# EasyEDA Pro project ProPrj_GeniusGateway_2025-07-29.epro

# Schematic Main
Board Name: Main; Create Date: 2025-07-15; Page Name: P1; Project Name: GeniusGateway; Schematic Name: Main; Update Date: 2025-07-18; Company: EasyEDA.com; Page Size: A4; Version: V1.0
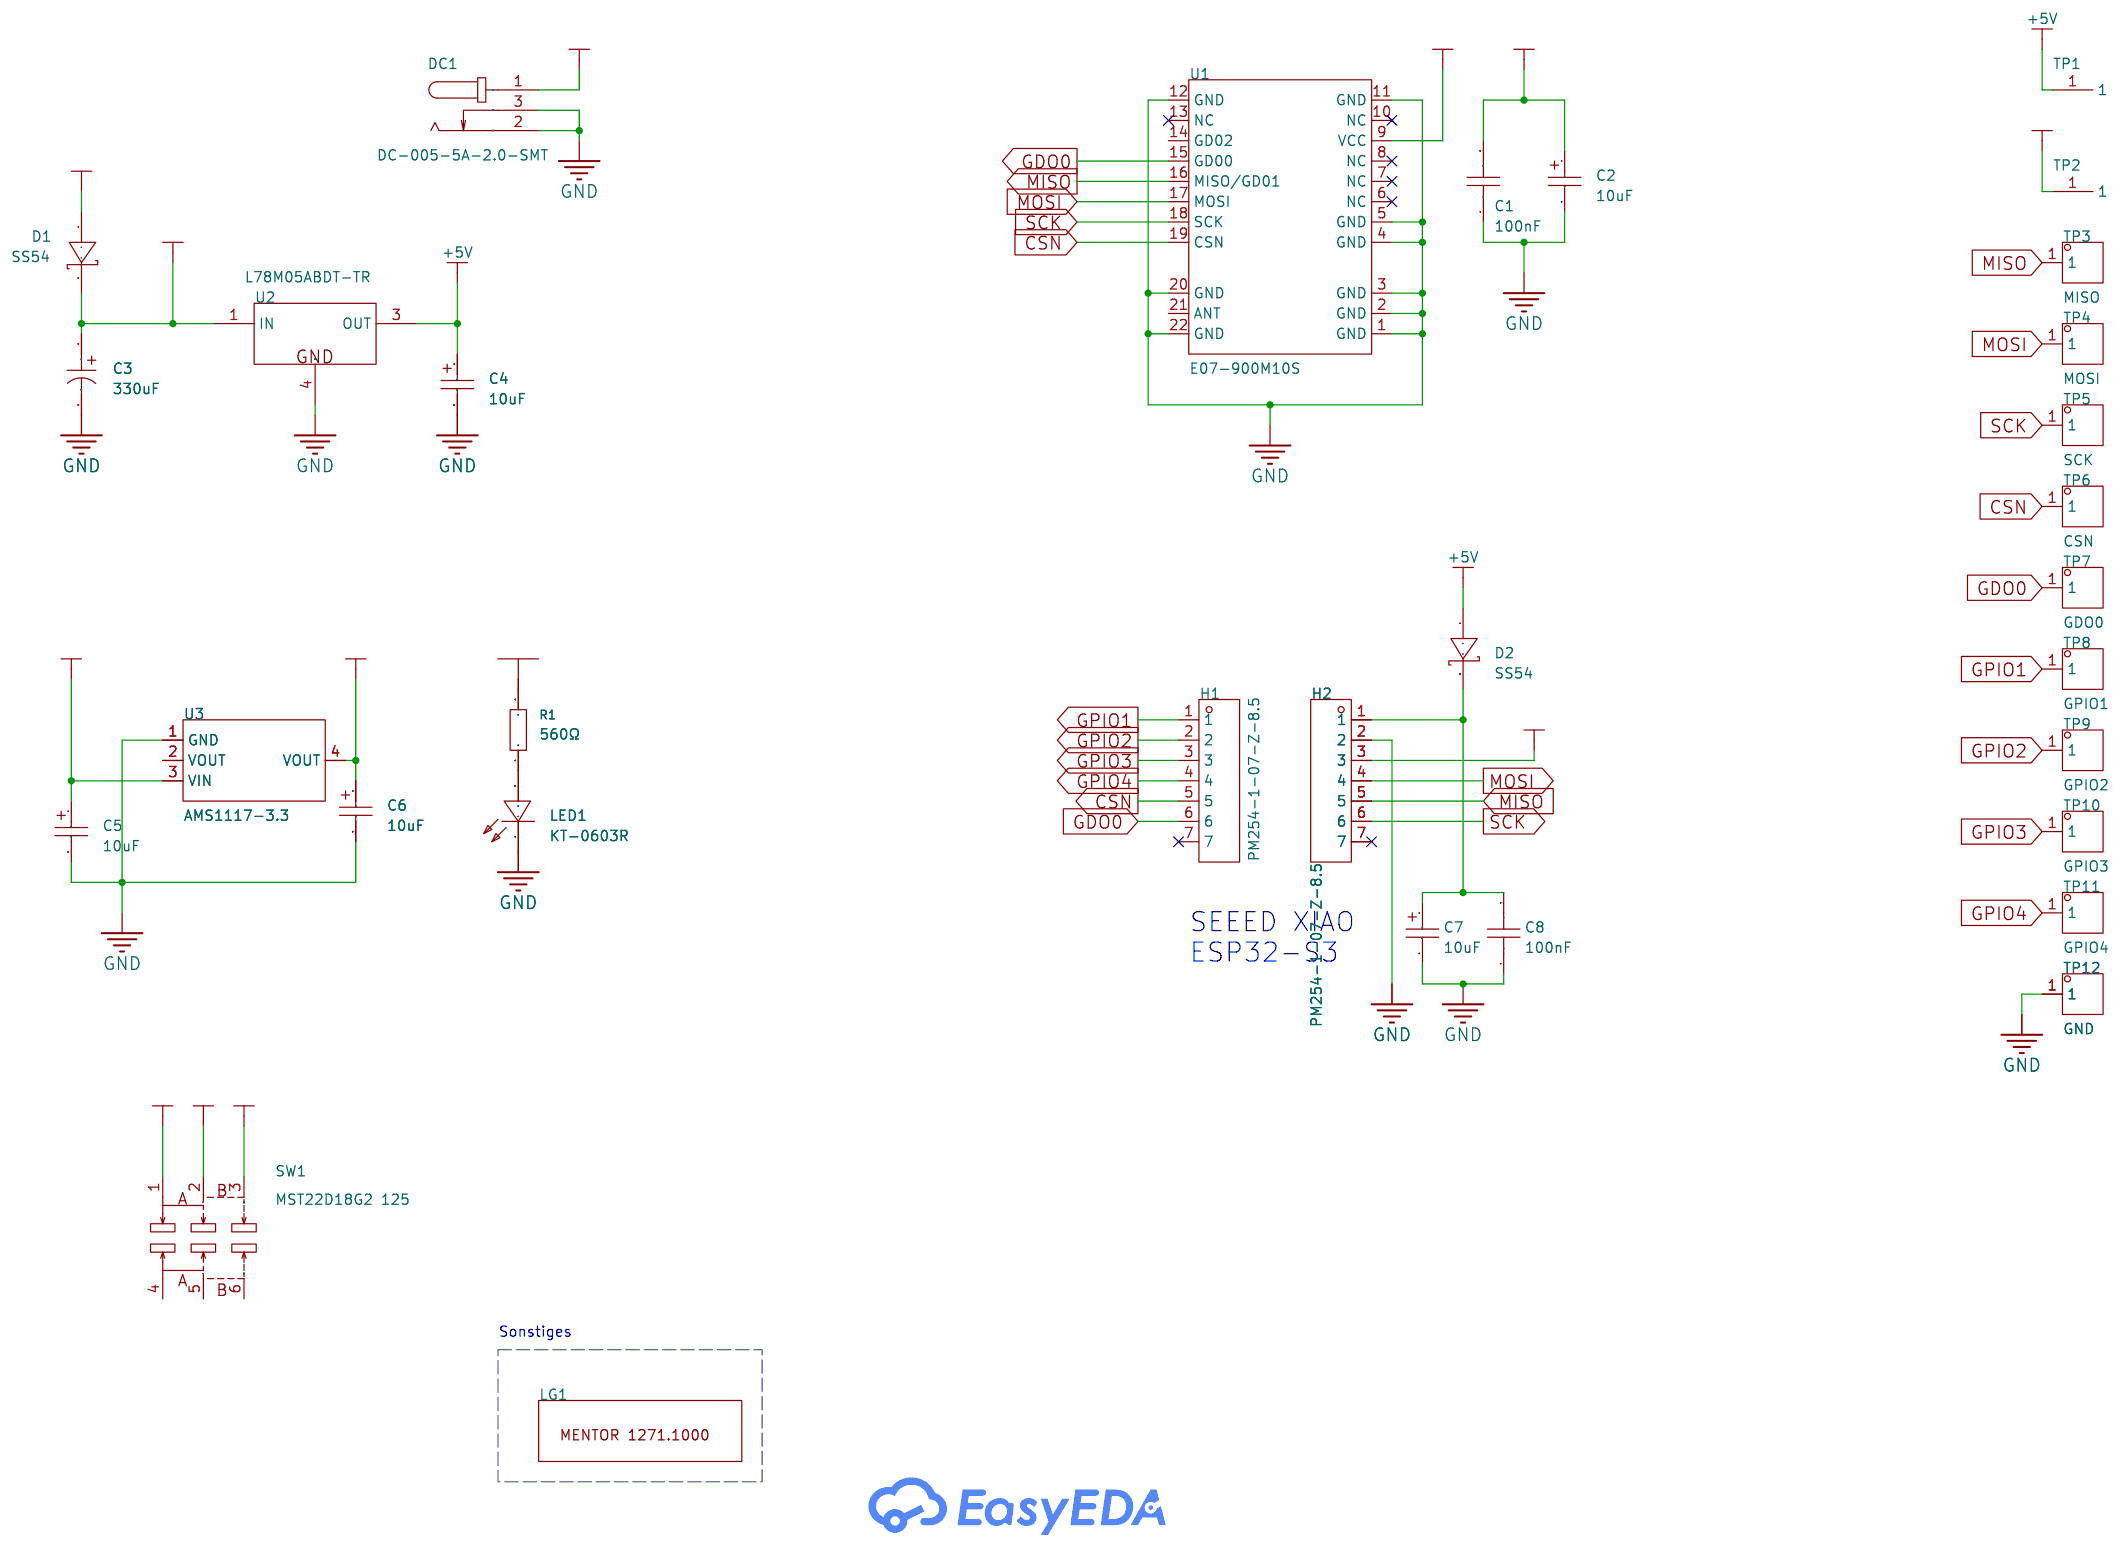
[diagram p0: schematic sheet]

## Parts
C1  100nF  [C0805]
C2  10uF  [CAP-SMD_L3.2-W1.6-RD-C7171]
C3  330uF  [CAP-SMD_BD6.3-L6.6-W6.6-LS7.6-RD]
C4  10uF  [CAP-SMD_L3.2-W1.6-RD-C7171]
C5  10uF  [CAP-SMD_L3.2-W1.6-RD-C7171]
C6  10uF  [CAP-SMD_L3.2-W1.6-RD-C7171]
C7  10uF  [CAP-SMD_L3.2-W1.6-RD-C7171]
C8  100nF  [C0805]
D1  SS54  [SMA_L4.4-W2.8-LS5.4-R-RD]
D2  SS54  [SMA_L4.4-W2.8-LS5.4-R-RD]
DC1  DC-005-5A-2.0-SMT  [DC-IN-TH_DC-005-5A-2.0-SMT]
H1  PM254-1-07-Z-8.5  [HDR-TH_7P-P2.54-V-F]
H2  PM254-1-07-Z-8.5  [HDR-TH_7P-P2.54-V-F]
LED1  KT-0603R  [LED0603-RD]
LG1  -  [MENTOR-1271.1000]  (no BOM)
R1  560Ω  [R0603]
SW1  MST22D18G2 125  [SW-SMD_MST22D18G2]
TP1  +5V  [Testpoint_SMD_R1.5_Border]  (no BOM)
TP2  3V3  [Testpoint_SMD_R1.5_Border]  (no BOM)
TP3  MISO  [TEST-TH_BD2.54-P1.39]
TP4  MOSI  [TEST-TH_BD2.54-P1.39]
TP5  SCK  [TEST-TH_BD2.54-P1.39]
TP6  CSN  [TEST-TH_BD2.54-P1.39]
TP7  GDO0  [TEST-TH_BD2.54-P1.39]
TP8  GPIO1  [TEST-TH_BD2.54-P1.39]
TP9  GPIO2  [TEST-TH_BD2.54-P1.39]
TP10  GPIO3  [TEST-TH_BD2.54-P1.39]
TP11  GPIO4  [TEST-TH_BD2.54-P1.39]
TP12  GND  [TEST-TH_BD2.54-P1.39]
U1  E07-900M10S  [WIRELM-SMD_22P-L20.0-W14.0-P1.27-BR]
U2  L78M05ABDT-TR  [TO-252-2_L6.5-W6.1-P4.58-LS10.0-TL]
U3  AMS1117-3.3  [SOT-223-3_L6.5-W3.4-P2.30-LS7.0-BR]

## Library data of the parts
C1 C8 = CC0805KRX7R9BB104: Capacitance: Tolerance:±10% Tolerance:±10% Voltage Rated: Temperature Coefficient:; LCSC Part Name: 100nF ±10% 50V; Supplier Part: C49678; Manufacturer: YAGEO(国巨); Supplier Footprint: 0805; JLCPCB Part Class: Basic Part; Datasheet: https://atta.szlcsc.com/upload/public/pdf/source/20180224/C181747_15194369449651363981.pdf; Supplier: LCSC; Tolerance: ±10%
C2 C4-C7 = TAJA106K016RNJ: Capacitance:10uF Tolerance:±10% Tolerance:±10% Voltage Rating:16V Equivalent Series Resistance(ESR):3Ω@100kHz Operating Temperature:-55℃~+125℃ Operating Temperature:-55℃~+125℃; LCSC Part Name: 10uF ±10% 16V; Supplier Part: C7171; Manufacturer: Kyocera AVX; Supplier Footprint: CASE-A-3216-18(mm); JLCPCB Part Class: Basic Part; Supplier: LCSC; Tolerance: ±10%; Voltage Rating: 16V; Equivalent Series Resistance(ESR): 3Ω@100kHz; Operating Temperature: -55℃~+125℃
C3 = 189RV0016: Capacitance: Tolerance:±20% Tolerance:±20% Rated Voltage: Ripple Current:600mA@100KHz Equivalent Series Resistance(ESR):160mΩ@100KHz φD: L: Lifetime @ Temp: Operating Temperature:-55℃~+105℃ Operating Temperature:-55℃~+105℃; LCSC Part Name: 330uF ±20% 25V; Supplier Part: C7471878; Manufacturer: KNSCHA(科尼盛); Supplier Footprint: SMD,D6.3xL7.7mm; JLCPCB Part Class: Extended Part; Datasheet: https://atta.szlcsc.com/upload/public/pdf/source/20230907/2CC9998DCC3B13BC64F25A423CB41A58.pdf; Supplier: LCSC; Tolerance: ±20%; Ripple Current: 600mA@100KHz; Equivalent Series Resistance(ESR): 160mΩ@100KHz; Operating Temperature: -55℃~+105℃
D1 D2 = SS54_C22452: Diode Configuration:Independent Type Forward Voltage (Vf@If):550mV@5A Reverse Voltage (Vr):40V Rectified Current:5A Reverse Leakage Current (Ir):1mA@40V; LCSC Part Name: 电压:40V 电流:5A; Supplier Part: C22452; Manufacturer: MDD(辰达半导体); Supplier Footprint: SMA(DO-214AC); JLCPCB Part Class: Basic Part; Datasheet: https://atta.szlcsc.com/upload/public/pdf/source/20240710/73DFBB65C1883B895E62D589679033DF.pdf; Supplier: LCSC; Diode Configuration: Independent Type; Forward Voltage (Vf@If): 550mV@5A; Reverse Voltage (Vr): 40V; Rectified Current: 5A; Reverse Leakage Current (Ir): 1mA@40V
DC1 = DC-005-5A-2.0-SMT: Connector Type:DC Power Receptacle Mounting Style:Panel Mounting Inside Contact Diameter:2mm Outside Contact Diameter:6.6mm Current Rating (Max):2.5A Voltage Rating (Max):24V Operating Temperature Range:-20℃~+70℃ Operating Temperature Range:-20℃~+70℃; LCSC Part Name: DC电源插座 内径:2mm 外径:6.6mm; Supplier Part: C319134; Manufacturer: XKB Connection(中国星坤); Supplier Footprint: SMD; JLCPCB Part Class: Extended Part; Datasheet: https://atta.szlcsc.com/upload/public/pdf/source/20181029/C319134_3C21841F55E6EB52BBFC76C1BD9D5CFF.pdf; Supplier: LCSC; Connector Type: DC Power Receptacle; Mounting Style: Panel Mounting; Inside Contact Diameter: 2mm; Outside Contact Diameter: 6.6mm; Current Rating (Max): 2.5A; Voltage Rating (Max): 24V; Operating Temperature Range: -20℃~+70℃
H1 H2 = PM254-1-07-Z-8.5: Holes Structure:1x7P Pitch:2.54mm Row Spacing:- Circular Hole / Square Hole:Square Holes Mounting Type:Straight Number of Rows:Plugin Number of Holes:7P Current Rating (Max):3A Voltage Rating (Max):- Holes Direction:Top Insulation Height:8.5mm Contact Mat; LCSC Part Name: 1x7P 间距:2.54mm 直插; Supplier Part: C2897370; Manufacturer: HCTL(华灿天禄); Supplier Footprint: 插件,P=2.54mm; JLCPCB Part Class: Extended Part; Datasheet: https://atta.szlcsc.com/upload/public/pdf/source/20230609/534BE42964C679BDE98E061007C4ABD6.pdf; Supplier: LCSC; Holes Structure: 1x7P; Pitch: 2.54mm; Circular Hole / Square Hole: Square Holes; Mounting Type: Straight; Number of Rows: Plugin; Number of Holes: 7P; Current Rating (Max): 3A; Holes Direction: Top; Insulation Height: 8.5mm; Contact Material: Copper Alloy; Operating Temperature Range: -40℃~+105℃; Soldering Temperature(Max): 260℃@5S
LED1 = KT-0603R: Emitted Color:Red Power Dissipation:- Forward Current:- Dominant Wavelength:- Dominant Wavelength:- Peak Wavelength:- Diode Configuration:- Lens Color:- Color Temperature:- Color Temperature:- Viewing Angle:- Mounting Sytle:- Operating Temperature:-40℃~+8; LCSC Part Name: 0603 红灯 高亮; Supplier Part: C2286; Manufacturer: KENTO; Supplier Footprint: 0603; JLCPCB Part Class: Basic Part; Datasheet: https://atta.szlcsc.com/upload/public/pdf/source/20160616/1466072038404.pdf; Supplier: LCSC; Emitted Color: Red; Operating Temperature: -40℃~+85℃
LG1 = Lightguide 1: MENTOR 1271.1000
R1 = 0603WAF5600T5E: Type:Thick Film Resistors Resistance: Tolerance:±1% Tolerance:±1% Power(Watts): Overload Voltage (Max): Temperature Coefficient:±100ppm/℃ Temperature Coefficient:±100ppm/℃ Operating Temperature Range:-55℃~+155℃ Operating Temperature Range:-55℃~+155℃; LCSC Part Name: 560Ω ±1% 100mW 厚膜电阻; Supplier Part: C23204; Manufacturer: UNI-ROYAL(厚声); Supplier Footprint: 0603; JLCPCB Part Class: Basic Part; Datasheet: https://atta.szlcsc.com/upload/public/pdf/source/20200306/C422600_1E6D84923E4A46A82E41ADD87F860B5C.pdf; Supplier: LCSC; Type: Thick Film Resistors; Tolerance: ±1%; Temperature Coefficient: ±100ppm/℃; Operating Temperature Range: -55℃~+155℃
SW1 = MST22D18G2 125: Circuit:DPDT Pin Style:Gull Wing Mounting Style:Brick nogging Actuator Color:Black Current Rating (DC):100mA Voltage Rating (DC):12V Mechanical Life:1万次 Operating Temperature:-25℃~+70℃ Operating Temperature:-25℃~+70℃; LCSC Part Name: 拨动开关/两档立式 6脚贴片 柄长2.0mm 大六立贴 9.1*3.5mm; Supplier Part: C2906280; Manufacturer: SHOU HAN(首韩); Supplier Footprint: SMD; JLCPCB Part Class: Extended Part; Datasheet: https://atta.szlcsc.com/upload/public/pdf/source/20211019/449AD4EDF23AADA7A5C4E3C063EDBB30.pdf; Supplier: LCSC; Circuit: DPDT; Pin Style: Gull Wing; Mounting Style: Brick nogging; Actuator Color: Black; Current Rating (DC): 100mA; Voltage Rating (DC): 12V; Mechanical Life: 1万次; Operating Temperature: -25℃~+70℃
TP1 TP2 = Testpoint1
TP3-TP12 = 5001_C238122: Connector Type:Pin type (through board) Plastic Color:Black Board Space (Diameter φ/ Length x Width):2.5mm; LCSC Part Name: 5001; Supplier Part: C238122; Manufacturer: Keystone; Manufacturer Part: 5001; Supplier Footprint: 插件; JLCPCB Part Class: Extended Part; Datasheet: https://atta.szlcsc.com/upload/public/pdf/source/20211115/64B944F8418AA2CF0680BB1B201435FB.pdf; Supplier: LCSC; Connector Type: Pin type (through board); Plastic Color: Black; Board Space (Diameter φ/ Length x Width): 2.5mm
U1 = E07-900M10S: Supplier Part: C9900007000; Supplier Footprint: LCC-22_L20.0-W14.0-P1.27; JLCPCB Part Class: Extended Part; Supplier: LCSC
U2 = L78M05ABDT-TR: Output Type:Fixed Maximum Input Voltage:35V Output Voltage:5V Output Voltage:5V Output Current:500mA Power Supply Rejection Ratio (PSRR):62dB@(120Hz) Dropout Voltage:- standby current:6mA Feature:Short-Circuit  Protection；Thermal Protection(TSD)；Overcurre; LCSC Part Name: 精密500 mA稳压器; Supplier Part: C58069; Manufacturer: ST(意法半导体); Supplier Footprint: TO-252-2(DPAK); JLCPCB Part Class: Basic Part; Datasheet: https://atta.szlcsc.com/upload/public/pdf/source/20230728/311D30A65517FCBD6FE5D1CCA2CA8430.pdf; Supplier: LCSC; Output Type: Fixed; Maximum Input Voltage: 35V; Output Voltage: 5V; Output Current: 500mA; Power Supply Rejection Ratio (PSRR): 62dB@(120Hz); standby current: 6mA; Feature: Short-Circuit  Protection；Thermal Protection(TSD)；Overcurrent Protection(OCP); Operating Temperature: -40℃~+125℃; Output Polarity: Positive electrode; Number of Outputs: 1
U3 = AMS1117-3.3_C6186: Output Type:Fixed Voltage - Supply:16V Output Voltage:3.3V Output Voltage:3.3V Output Current:1A Power Supply Rejection Ratio (PSRR):72dB@(120Hz) Voltage Dropout:1.1V@(800mA) standby current:5mA Noise:- Features:Over Current Protection；Over Temperature Pr; LCSC Part Name: 输出3.3V 1A; Supplier Part: C6186; Manufacturer: AMS; Supplier Footprint: SOT-223; JLCPCB Part Class: Basic Part; Datasheet: https://atta.szlcsc.com/upload/public/pdf/source/20180727/C6186_7A095716F0823C02F1997A905E26C086.pdf; Supplier: LCSC; Output Type: Fixed; Voltage - Supply: 16V; Output Voltage: 3.3V; Output Current: 1A; Power Supply Rejection Ratio (PSRR): 72dB@(120Hz); Voltage Dropout: 1.1V@(800mA); standby current: 5mA; Features: Over Current Protection；Over Temperature Protection; Operating Temperature: -40℃~+125℃; Output Configuration: Positive; Number of Outputs: 1

## Nets
+3V3: C1.2 C2.1 R1.2 SW1.2 TP2.1 U1.9(VCC)
+3V3-LDO: C6.1 SW1.1 U3.4(VOUT)
+3V3-XIAO: H2.3 SW1.3
+5V: C4.1 C5.1 D2.1(A) TP1.1 U2.3(OUT) U3.3(VIN)
+12V: C3.1 D1.2(K) U2.1(IN)
+12V_IN: D1.1(A) DC1.1
GND: C1.1 C2.2 C3.2 C4.2 C5.2 C6.2 C7.2 C8.1 DC1.2 DC1.3 H2.2 LED1.1(K) TP12.1 U1.1(GND) U1.2(GND) U1.3(GND) U1.4(GND) U1.5(GND) U1.11(GND) U1.12(GND) U1.20(GND) U1.22(GND) U2.4(GND) U3.1(GND)
CSN: H1.5 TP6.1 U1.19(CSN)
GDO0: H1.6 TP7.1 U1.15(GD00)
GPIO1: H1.1 TP8.1
GPIO2: H1.2 TP9.1
GPIO3: H1.3 TP10.1
GPIO4: H1.4 TP11.1
MISO: H2.5 TP3.1 U1.16(MISO/GD01)
MOSI: H2.4 TP4.1 U1.17(MOSI)
SCK: H2.6 TP5.1 U1.18(SCK)
$1N1660: C7.1 C8.2 D2.2(K) H2.1
$1N5727: LED1.2(A) R1.1

Not connected (* = marked no-connect by the designer): H1 7*; H2 7*; SW1 4 5 6; U1 6(NC)* 7(NC)* 8(NC)* 10(NC)* 13(NC)* 14(GD02) 21(ANT); U3 2(VOUT)

## Notes on the sheet
- SEEED XIAO
  ESP32-S3
- Sonstiges

# Board Main
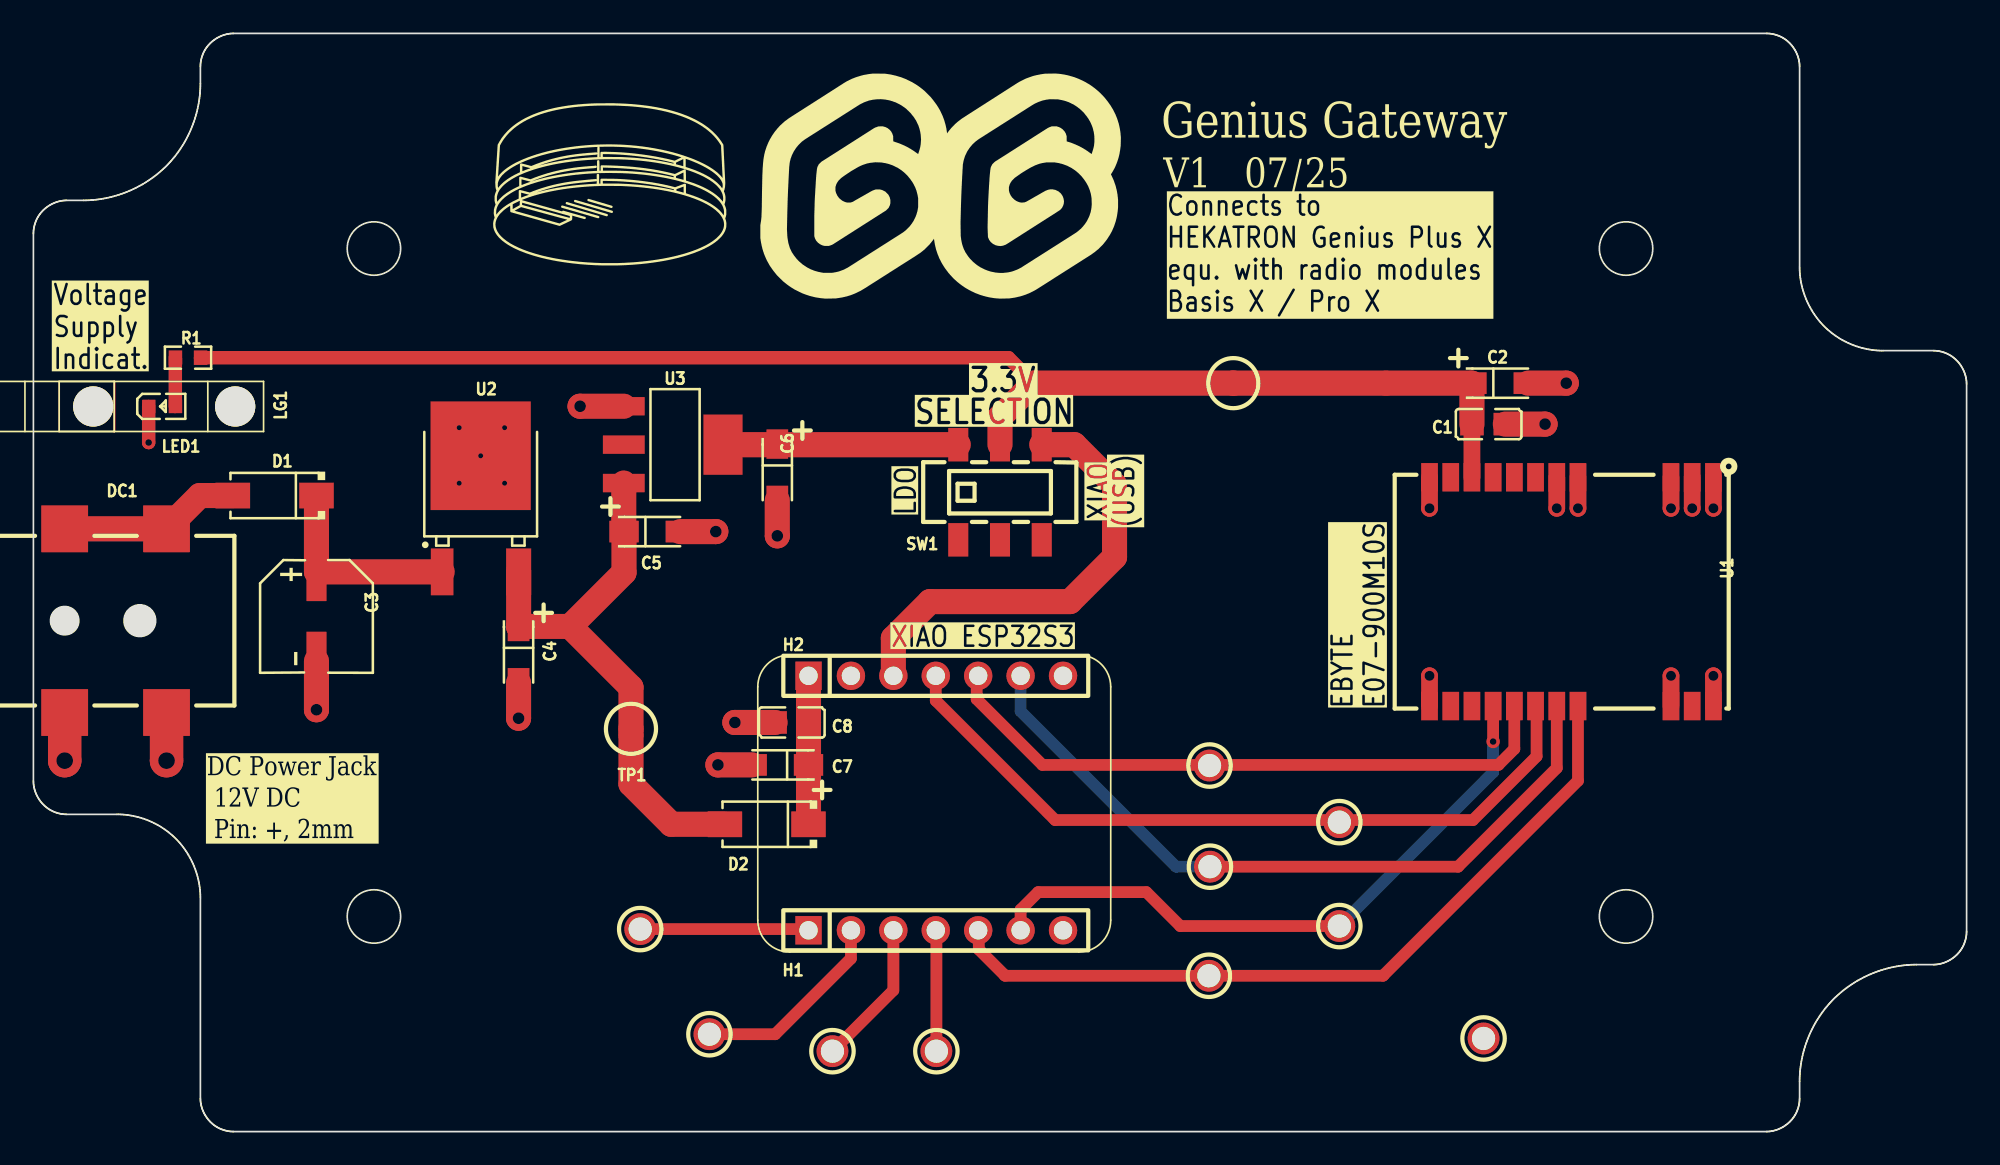
[diagram p1: board, top side]
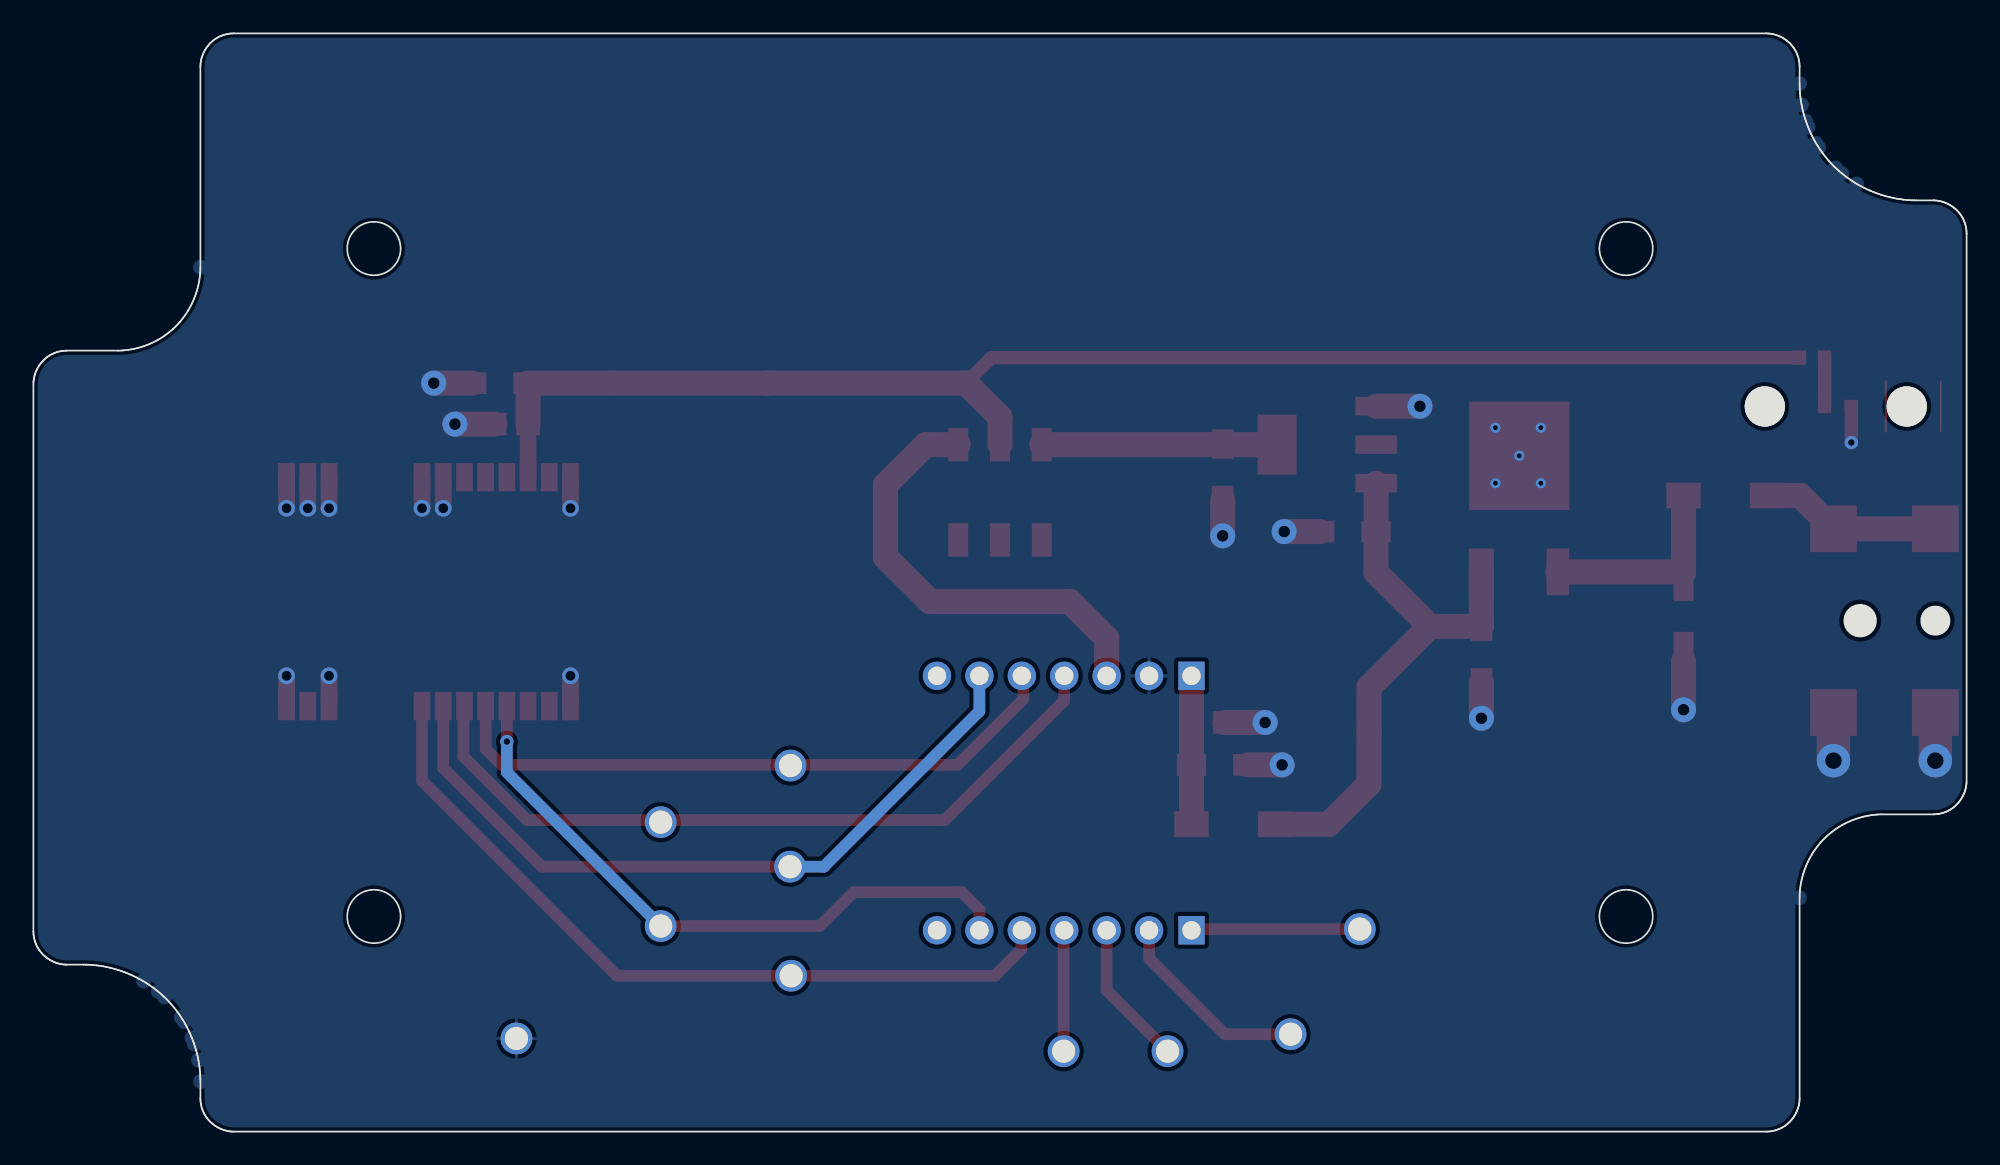
[diagram p2: board, bottom side, seen from below]

Outline 115.76 x 65.76 mm; copper layers: Top Layer, Bottom Layer. Coordinates in mm from the lower left corner of the outline.
Outline path: circle c20.39,52.88 r1.6 ; circle c20.39,12.88 r1.6 ; circle c95.37,52.88 r1.6 ; circle c95.37,12.88 r1.6 ; 0,53.77 0,21 0,20.93 0,20.87 0.01,20.81 0.02,20.74 0.03,20.68 0.04,20.62 0.05,20.55 0.07,20.49 0.09,20.43 0.11,20.37 0.13,20.31 0.15,20.25 0.18,20.19 0.2,20.13 0.23,20.08 0.26,20.02 0.3,19.97 0.33,19.91 0.37,19.86 0.4,19.81 0.44,19.76 0.48,19.71 0.53,19.66 0.57,19.61 0.61,19.57 0.66,19.52 0.71,19.48 0.76,19.44 0.81,19.4 0.86,19.36 0.91,19.32 0.96,19.29 1.02,19.26 1.07,19.23 1.13,19.2 1.19,19.17 1.25,19.14 1.31,19.12 1.37,19.1 1.43,19.08 1.49,19.06 1.55,19.05 1.62,19.04 1.68,19.02 1.74,19.02 1.81,19.01 1.87,19 1.94,19 2,19 5,19 5.1,19 5.2,18.99 5.3,18.99 5.4,18.98 5.5,18.97 5.6,18.96 5.69,18.95 5.79,18.93 5.89,18.92 5.99,18.9 6.09,18.88 6.18,18.86 6.28,18.83 6.37,18.8 6.47,18.78 6.56,18.75 6.66,18.71 6.75,18.68 6.84,18.64 6.94,18.61 7.03,18.57 7.12,18.53 7.21,18.48 7.3,18.44 7.38,18.39 7.47,18.34 7.56,18.29 7.64,18.24 7.73,18.19 7.81,18.14 7.89,18.08 7.97,18.02 8.05,17.96 8.13,17.9 8.21,17.84 8.28,17.77 8.36,17.71 8.43,17.64 8.5,17.57 8.57,17.5 8.64,17.43 8.7,17.35 8.77,17.28 8.83,17.2 8.9,17.13 8.96,17.05 9.02,16.97 9.07,16.89 9.13,16.81 9.19,16.72 9.24,16.64 9.29,16.55 9.34,16.47 9.39,16.38 9.43,16.29 9.48,16.2 9.52,16.11 9.56,16.02 9.6,15.93 9.64,15.84 9.68,15.75 9.71,15.65 9.74,15.56 9.77,15.47 9.8,15.37 9.83,15.28 9.85,15.18 9.88,15.08 9.9,14.99 9.92,14.89 9.93,14.79 9.95,14.69 9.96,14.59 9.97,14.5 9.98,14.4 9.99,14.3 10,14.2 10,14.1 10,14 10,2 10,1.94 10,1.87 10.01,1.81 10.02,1.74 10.03,1.68 10.04,1.62 10.05,1.56 10.07,1.49 10.09,1.43 10.11,1.37 10.13,1.31 10.15,1.25 10.18,1.19 10.2,1.14 10.23,1.08 10.26,1.02 10.3,0.97 10.33,0.91 10.37,0.86 10.4,0.81 10.44,0.76 10.48,0.71 10.52,0.66 10.57,0.61 10.61,0.57 10.66,0.52 10.71,0.48 10.76,0.44 10.81,0.4 10.86,0.36 10.91,0.32 10.96,0.29 11.02,0.26 11.07,0.23 11.13,0.2 11.19,0.17 11.25,0.15 11.31,0.12 11.37,0.1 11.43,0.08 11.49,0.07 11.55,0.05 11.62,0.04 11.68,0.03 11.74,0.02 11.81,0.01 11.87,0 11.93,0 12,0 103.76,0 103.83,0 103.89,0 103.96,0.01 104.02,0.02 104.08,0.03 104.15,0.04 104.21,0.05 104.27,0.07 104.33,0.09 104.39,0.11 104.45,0.13 104.51,0.15 104.57,0.18 104.63,0.2 104.69,0.23 104.74,0.26 104.8,0.3 104.85,0.33 104.9,0.37 104.96,0.4 105.01,0.44 105.06,0.48 105.1,0.53 105.15,0.57 105.2,0.61 105.24,0.66 105.28,0.71 105.33,0.76 105.36,0.81 105.4,0.86 105.44,0.91 105.47,0.96 105.51,1.02 105.54,1.07 105.57,1.13 105.59,1.19 105.62,1.25 105.64,1.31 105.66,1.37 105.68,1.43 105.7,1.49 105.71,1.55 105.73,1.62 105.74,1.68 105.75,1.74 105.75,1.81 105.76,1.87 105.76,1.93 105.76,2 105.76,3 105.76,3.1 105.77,3.2 105.77,3.3 105.77,3.4 105.78,3.5 105.79,3.59 105.8,3.69 105.81,3.79 105.82,3.89 105.83,3.99 105.85,4.09 105.87,4.18 105.88,4.28 105.9,4.38 105.92,4.47 105.95,4.57 105.97,4.67 105.99,4.76 106.02,4.86 106.05,4.95 106.07,5.05 106.1,5.14 106.14,5.24 106.17,5.33 106.2,5.42 106.24,5.52 106.27,5.61 106.31,5.7 106.35,5.79 106.39,5.88 106.43,5.97 106.47,6.06 106.52,6.15 106.56,6.24 106.61,6.33 106.66,6.41 106.7,6.5 106.75,6.58 106.8,6.67 106.86,6.75 106.91,6.84 106.96,6.92 107.02,7 107.08,7.08 107.14,7.16 107.2,7.24 107.26,7.32 107.32,7.4 107.38,7.47 107.44,7.55 107.51,7.63 107.57,7.7 107.64,7.77 107.71,7.84 107.78,7.91 107.85,7.98 107.92,8.05 107.99,8.12 108.06,8.19 108.14,8.25 108.21,8.32 108.29,8.38 108.37,8.44 108.44,8.5 108.52,8.56 108.6,8.62 108.68,8.68 108.76,8.74 108.84,8.79 108.93,8.85 109.01,8.9 109.09,8.95 109.18,9.01 109.27,9.06 109.35,9.1 109.44,9.15 109.53,9.2 109.61,9.24 109.7,9.29 109.79,9.33 109.88,9.37 109.97,9.41 110.06,9.45 110.16,9.49 110.25,9.52 110.34,9.56 110.43,9.59 110.53,9.62 110.62,9.66 110.71,9.69 110.81,9.72 110.9,9.74 111,9.77 111.1,9.79 111.19,9.82 111.29,9.84 111.39,9.86 111.48,9.88 111.58,9.9 111.68,9.91 111.77,9.93 111.87,9.94 111.97,9.95 112.07,9.96 112.17,9.97 112.27,9.98 112.36,9.99 112.46,9.99 112.56,10 112.66,10 112.76,10 113.76,10 113.83,10 113.89,10 113.96,10.01 114.02,10.02 114.08,10.03 114.14,10.04 114.21,10.05 114.27,10.07 114.33,10.09 114.39,10.11 114.45,10.13 114.51,10.15 114.57,10.18 114.63,10.2 114.68,10.23 114.74,10.26 114.8,10.3 114.85,10.33 114.9,10.37 114.95,10.4 115.01,10.44 115.06,10.48 115.1,10.52 115.15,10.57 115.2,10.61 115.24,10.66 115.28,10.71 115.32,10.75 115.36,10.81 115.4,10.86 115.44,10.91 115.47,10.96 115.51,11.02 115.54,11.07 115.57,11.13 115.59,11.19 115.62,11.25 115.64,11.31 115.66,11.37 115.68,11.43 115.7,11.49 115.71,11.55 115.73,11.62 115.74,11.68 115.75,11.74 115.75,11.81 115.76,11.87 115.76,11.93 115.76,12 115.76,44.77 115.76,44.83 115.76,44.89 115.75,44.96 115.74,45.02 115.74,45.09 115.72,45.15 115.71,45.21 115.69,45.27 115.68,45.33 115.66,45.39 115.63,45.45 115.61,45.51 115.59,45.57 115.56,45.63 115.53,45.69 115.5,45.74 115.47,45.8 115.43,45.85 115.4,45.91 115.36,45.96 115.32,46.01 115.28,46.06 115.24,46.11 115.19,46.15 115.15,46.2 115.1,46.24 115.06,46.29 115.01,46.33 114.96,46.37 114.91,46.4 114.85,46.44 114.8,46.48 114.74,46.51 114.69,46.54 114.63,46.57 114.57,46.59 114.51,46.62 114.45,46.64 114.39,46.66 114.33,46.68 114.27,46.7 114.21,46.72 114.15,46.73 114.08,46.74 114.02,46.75 113.96,46.76 113.89,46.76 113.83,46.76 113.76,46.77 110.76,46.77 110.66,46.77 110.56,46.77 110.46,46.77 110.36,46.78 110.27,46.79 110.17,46.8 110.07,46.82 109.97,46.83 109.87,46.85 109.77,46.87 109.68,46.89 109.58,46.91 109.48,46.93 109.39,46.96 109.29,46.99 109.2,47.02 109.11,47.05 109.01,47.08 108.92,47.12 108.83,47.16 108.74,47.2 108.64,47.24 108.55,47.28 108.47,47.33 108.38,47.37 108.29,47.42 108.21,47.47 108.12,47.52 108.04,47.57 107.95,47.63 107.87,47.69 107.79,47.74 107.71,47.8 107.63,47.86 107.56,47.93 107.48,47.99 107.41,48.06 107.33,48.13 107.26,48.2 107.19,48.27 107.13,48.34 107.06,48.41 106.99,48.49 106.93,48.56 106.87,48.64 106.81,48.72 106.75,48.8 106.69,48.88 106.63,48.96 106.58,49.04 106.52,49.13 106.47,49.21 106.42,49.3 106.38,49.38 106.33,49.47 106.28,49.56 106.24,49.65 106.2,49.74 106.16,49.83 106.12,49.92 106.09,50.02 106.05,50.11 106.02,50.2 105.99,50.3 105.96,50.39 105.93,50.49 105.91,50.58 105.89,50.68 105.87,50.78 105.85,50.88 105.83,50.97 105.81,51.07 105.8,51.17 105.79,51.27 105.78,51.37 105.77,51.47 105.77,51.57 105.76,51.66 105.76,51.76 105.76,63.77 105.76,63.83 105.76,63.89 105.75,63.96 105.75,64.02 105.74,64.08 105.72,64.15 105.71,64.21 105.69,64.27 105.68,64.33 105.66,64.39 105.64,64.45 105.61,64.51 105.59,64.57 105.56,64.63 105.53,64.69 105.5,64.74 105.47,64.8 105.43,64.85 105.4,64.91 105.36,64.96 105.32,65.01 105.28,65.06 105.24,65.11 105.2,65.15 105.15,65.2 105.1,65.24 105.06,65.29 105.01,65.33 104.96,65.37 104.91,65.4 104.85,65.44 104.8,65.47 104.74,65.51 104.69,65.54 104.63,65.57 104.57,65.59 104.52,65.62 104.45,65.64 104.39,65.66 104.33,65.68 104.27,65.7 104.21,65.71 104.15,65.73 104.08,65.74 104.02,65.75 103.96,65.76 103.89,65.76 103.83,65.76 103.76,65.76 12,65.76 11.93,65.76 11.87,65.76 11.81,65.75 11.74,65.75 11.68,65.74 11.62,65.73 11.56,65.71 11.49,65.7 11.43,65.68 11.37,65.66 11.31,65.64 11.25,65.61 11.19,65.59 11.14,65.56 11.08,65.53 11.02,65.5 10.97,65.47 10.91,65.43 10.86,65.4 10.81,65.36 10.76,65.32 10.71,65.28 10.66,65.24 10.61,65.2 10.57,65.15 10.52,65.11 10.48,65.06 10.44,65.01 10.4,64.96 10.36,64.91 10.32,64.86 10.29,64.8 10.26,64.75 10.23,64.69 10.2,64.63 10.17,64.58 10.15,64.52 10.12,64.46 10.1,64.4 10.08,64.33 10.07,64.27 10.05,64.21 10.04,64.15 10.03,64.09 10.02,64.02 10.01,63.96 10,63.89 10,63.83 10,63.77 10,62.76 10,62.66 10,62.56 9.99,62.47 9.99,62.37 9.98,62.27 9.97,62.17 9.96,62.07 9.95,61.97 9.94,61.88 9.93,61.78 9.91,61.68 9.9,61.58 9.88,61.48 9.86,61.39 9.84,61.29 9.82,61.19 9.79,61.1 9.77,61 9.74,60.91 9.72,60.81 9.69,60.72 9.66,60.62 9.63,60.53 9.59,60.43 9.56,60.34 9.53,60.25 9.49,60.16 9.45,60.06 9.41,59.97 9.37,59.88 9.33,59.79 9.29,59.7 9.25,59.61 9.2,59.53 9.16,59.44 9.11,59.35 9.06,59.27 9.01,59.18 8.96,59.09 8.91,59.01 8.85,58.93 8.8,58.85 8.74,58.76 8.69,58.68 8.63,58.6 8.57,58.52 8.51,58.44 8.45,58.37 8.38,58.29 8.32,58.21 8.26,58.14 8.19,58.07 8.12,57.99 8.05,57.92 7.98,57.85 7.92,57.78 7.84,57.71 7.77,57.64 7.7,57.58 7.62,57.51 7.55,57.45 7.47,57.38 7.4,57.32 7.32,57.26 7.24,57.2 7.16,57.14 7.08,57.08 7,57.03 6.92,56.97 6.84,56.92 6.75,56.86 6.67,56.81 6.58,56.76 6.5,56.71 6.41,56.66 6.33,56.61 6.24,56.57 6.15,56.52 6.06,56.48 5.97,56.44 5.88,56.39 5.79,56.35 5.7,56.32 5.61,56.28 5.52,56.24 5.42,56.21 5.33,56.17 5.24,56.14 5.14,56.11 5.05,56.08 4.95,56.05 4.86,56.02 4.76,56 4.67,55.97 4.57,55.95 4.47,55.93 4.38,55.91 4.28,55.89 4.18,55.87 4.09,55.85 3.99,55.84 3.89,55.82 3.79,55.81 3.69,55.8 3.59,55.79 3.5,55.78 3.4,55.78 3.3,55.77 3.2,55.77 3.1,55.77 3,55.77 2,55.77 1.94,55.76 1.87,55.76 1.81,55.76 1.74,55.75 1.68,55.74 1.62,55.73 1.56,55.71 1.49,55.7 1.43,55.68 1.37,55.66 1.31,55.64 1.25,55.61 1.19,55.59 1.14,55.56 1.08,55.53 1.02,55.5 0.97,55.47 0.91,55.43 0.86,55.4 0.81,55.36 0.76,55.32 0.71,55.28 0.66,55.24 0.61,55.2 0.57,55.15 0.52,55.11 0.48,55.06 0.44,55.01 0.4,54.96 0.36,54.91 0.33,54.86 0.29,54.8 0.26,54.75 0.23,54.69 0.2,54.63 0.17,54.58 0.15,54.52 0.12,54.46 0.1,54.4 0.08,54.34 0.07,54.27 0.05,54.21 0.04,54.15 0.03,54.09 0.02,54.02 0.01,53.96 0,53.89 0,53.83 0,53.77
Stack: Top Layer 0.035mm / Dielectric1 1.51mm FR4 er 4.5 / Bottom Layer 0.035mm

## Design rules (mm)
template: JLCPCB Capability(Two Layers Board)
spacing copperThickness1oz (default): track to track 0.102, other pairs 0.152 to 0.3
spacing copperThickness2oz: track to track 0.203, other pairs 0.152 to 0.3
track width copperThickness1oz (default): min 0.127, default 0.254, max 2.54
track width copperThickness2oz: min 0.203, default 0.254, max 2.54
differential pair differentialPair (default): width min 0.127, default 0.254, max 2.54; gap min 0.152, default 0.152
via viaSize (default): diameter min 0.5, default 0.61, max 10; hole min 0.3, default 0.305, max 6.3

## Placement (name value [footprint] x y rotation side)
C1  100nF  [C0805]  87.14 42.37 180 top
C2  10uF  [CAP-SMD_L3.2-W1.6-RD-C7171]  87.83 44.82 0 top
C3  330uF  [CAP-SMD_BD6.3-L6.6-W6.6-LS7.6-RD]  16.95 30.85 270 top
C4  10uF  [CAP-SMD_L3.2-W1.6-RD-C7171]  29.05 28.56 270 top
C5  10uF  [CAP-SMD_L3.2-W1.6-RD-C7171]  37.05 35.93 0 top
C6  10uF  [CAP-SMD_L3.2-W1.6-RD-C7171]  44.55 39.49 270 top
C7  10uF  [CAP-SMD_L3.2-W1.6-RD-C7171]  44.73 21.96 180 top
C8  100nF  [C0805]  45.42 24.5 0 top
D1  SS54  [SMA_L4.4-W2.8-LS5.4-R-RD]  14.45 38.09 180 top
D2  SS54  [SMA_L4.4-W2.8-LS5.4-R-RD]  43.91 18.4 180 top
DC1  DC-005-5A-2.0-SMT  [DC-IN-TH_DC-005-5A-2.0-SMT]  4.92 30.6 0 top
H1  PM254-1-07-Z-8.5  [HDR-TH_7P-P2.54-V-F]  54.04 12.05 0 top
H2  PM254-1-07-Z-8.5  [HDR-TH_7P-P2.54-V-F]  54.04 27.29 0 top
LED1  KT-0603R  [LED0603-RD]  7.71 43.42 0 top
LG1  -  [MENTOR-1271.1000]  7.38 43.42 90 top
R1  560Ω  [R0603]  9.26 46.34 0 top
SW1  MST22D18G2 125  [SW-SMD_MST22D18G2]  57.88 38.29 0 top
TP1  +5V  [Testpoint_SMD_R1.5_Border]  35.78 24.12 0 top
TP2  3V3  [Testpoint_SMD_R1.5_Border]  71.85 44.82 0 top
TP3  MISO  [TEST-TH_BD2.54-P1.39]  70.43 21.92 90 top
TP4  MOSI  [TEST-TH_BD2.54-P1.39]  78.2 18.53 90 top
TP5  SCK  [TEST-TH_BD2.54-P1.39]  70.45 15.86 90 top
TP6  CSN  [TEST-TH_BD2.54-P1.39]  70.39 9.33 90 top
TP7  GDO0  [TEST-TH_BD2.54-P1.39]  78.2 12.31 90 top
TP8  GPIO1  [TEST-TH_BD2.54-P1.39]  36.34 12.13 90 top
TP9  GPIO2  [TEST-TH_BD2.54-P1.39]  40.48 5.83 90 top
TP10  GPIO3  [TEST-TH_BD2.54-P1.39]  47.85 4.82 90 top
TP11  GPIO4  [TEST-TH_BD2.54-P1.39]  54.07 4.82 90 top
TP12  GND  [TEST-TH_BD2.54-P1.39]  86.84 5.58 90 top
U1  E07-900M10S  [WIRELM-SMD_22P-L20.0-W14.0-P1.27-BR]  92.1 32.33 90 top
U2  L78M05ABDT-TR  [TO-252-2_L6.5-W6.1-P4.58-LS10.0-TL]  26.77 37 90 top
U3  AMS1117-3.3  [SOT-223-3_L6.5-W3.4-P2.30-LS7.0-BR]  38.32 41.14 180 top

## Footprints (pads in the part's own frame, mm; a bottom-side part is the same pattern mirrored in y, then rotated)
C0805
  rect 1.41x1.35 smd: 1(-1,0) 2(1,0)
CAP-SMD_BD6.3-L6.6-W6.6-LS7.6-RD
  rect 3.5x1.2 smd: 1(-2.67,0) 2(2.67,0)
CAP-SMD_L3.2-W1.6-RD-C7171
  rect 1.758x1.296 smd: 1(-1.687,0) 2(1.687,0)
DC-IN-TH_DC-005-5A-2.0-SMT
  rect 2.8x2.8 smd: 1(-3.05,5.5) 1(3.05,5.5) 2(-3.05,-5.5) 3(3.05,-5.5)
HDR-TH_7P-P2.54-V-F
  rect 1.575x1.7 hole 1.1: 1(-7.62,0)
  round 1.7 hole 1.1: 2(-5.08,0) 3(-2.54,0) 4(0,0) 5(2.54,0) 6(5.08,0) 7(7.62,0)
LED0603-RD
  rect 0.8x0.8 smd: 1(-0.799,0) 2(0.799,0)
MENTOR-1271.1000
  round 2.4 hole 2.4: 0(0,3.8) 0(0,-4.7)
R0603
  rect 0.806x0.864 smd: 1(-0.753,0) 2(0.753,0)
SMA_L4.4-W2.8-LS5.4-R-RD
  rect 2.062x1.539 smd: 1(2.503,0) 2(-2.503,0)
SOT-223-3_L6.5-W3.4-P2.30-LS7.0-BR
  rect 2.5x1.1 smd: 1(2.97,-2.3) 2(2.97,0) 3(2.97,2.3)
  rect 2.34x3.6 smd: 4(-2.97,0)
SW-SMD_MST22D18G2
  rect 1.2x2 smd: 1(-2.5,2.85) 2(0,2.85) 3(2.5,2.85) 4(-2.5,-2.85) 5(0,-2.85) 6(2.5,-2.85)
TEST-TH_BD2.54-P1.39
  round 1.9 hole 1.39: 1(0,0)
Testpoint_SMD_R1.5_Border
  round 1.524 smd: 1(0,0)
TO-252-2_L6.5-W6.1-P4.58-LS10.0-TL
  rect 2.8x1.35 smd: 1(-3.475,2.29)
  rect 2.8x1.5 smd: 3(-3.475,-2.29)
  rect 6.5x6 smd: 4(3.475,-0.017)
WIRELM-SMD_22P-L20.0-W14.0-P1.27-BR
  rect 1.7x1 smd: 1(6.85,-8.5) 2(6.85,-7.23) 3(6.85,-5.96) 4(6.85,-0.39) 5(6.85,0.88) 6(6.85,2.15) 7(6.85,3.42) 8(6.85,4.69) 9(6.85,5.96) 10(6.85,7.23) 11(6.85,8.5) 12(-6.85,8.5) 13(-6.85,7.23) 14(-6.85,5.96) 15(-6.85,4.69) 16(-6.85,3.42) 17(-6.85,2.15) 18(-6.85,0.88) 19(-6.85,-0.39) 20(-6.85,-5.96) 21(-6.85,-7.23) 22(-6.85,-8.5)

## Nets
As in the schematic.

Pads without a net: H1 7; H2 7; LG1 0; SW1 4 5 6; U1 6 7 8 10 13 14 21; U3 2

## Via types
v1: diameter 0.61, hole 0.305, Top Layer to Bottom Layer, 5 vias
v2: diameter 1, hole 0.6, Top Layer to Bottom Layer, 9 vias
v3: diameter 1.5, hole 0.7, Top Layer to Bottom Layer, 9 vias
v4: diameter 0.8, hole 0.4, Top Layer to Bottom Layer, 2 vias
v5: diameter 2, hole 1, Top Layer to Bottom Layer, 2 vias

## Routing (per net, layer and track width the routed paths; a pad name or vN(x,y) marks a point on that pad's centre or on a via; arc(x,y) is an arc through that point)
+3V3: length 86.9
  Top Layer w0.8: 59.91,44.82 58.39,46.34 10.01,46.34
  Top Layer w1: C1.2 U1.9
  Top Layer w1.5: 86.1,44.82 TP2.1 59.91,44.82 57.88,42.79 SW1.2 ; C2.1 C1.2
+3V3-LDO: length 14.1
  Top Layer w1.5: U3.4 SW1.1
+3V3-XIAO: length 27.2
  Top Layer w1.5: H2.3 51.49,29.54 53.69,31.74 62.07,31.74 64.74,34.41 64.74,38.72 62.33,41.14 SW1.3
+5V: length 33.9
  Top Layer w1.5: 32.14,30.25 35.37,33.48 C5.1 35.35,35.94 U3.3 ; 32.14,30.25 C4.1 29.06,30.25 U2.3 ; 32.14,30.25 35.78,26.6 35.78,20.82 38.2,18.4 D2.1
+12V: length 12.1
  Top Layer w1.5: D1.2 C3.1 U2.1
+12V_IN: length 10.9
  Top Layer w1.5: DC1.1 DC1.1 9.97,38.09 D1.1
GND: length 45.5
  Top Layer w0.8: 6.9,43.42 v4(6.9,41.26)
  Top Layer w1: U1.22 v2(100.6,27.29) ; U1.4 v2(92.49,37.33) ; U1.1 v2(100.6,37.33) ; U1.11 v2(83.6,37.33) ; U1.12 v2(83.6,27.29) ; U1.5 v2(91.22,37.33) ; U1.20 v2(98.06,27.29) ; U1.2 v2(99.33,37.33) ; U1.3 v2(98.06,37.33)
  Top Layer w1.5: 35.35,43.44 v3(32.74,43.44) ; C2.2 v3(91.79,44.82) ; C8.1 v3(42.01,24.5) ; C5.2 v3(40.86,35.93) ; C4.2 v3(29.05,24.75) ; C1.1 v3(90.52,42.37) ; C3.2 v3(16.95,25.26) ; C7.2 v3(40.99,21.96) ; C6.2 v3(44.55,35.68)
  Top Layer w2: DC1.2 1.87,25.09 v5(1.87,22.21) ; DC1.3 v5(7.97,22.21)
  vias: v1(25.5,42.15) v1(25.5,38.83) v1(26.78,40.47) v1(28.22,42.15) v1(28.22,38.83)
CSN: length 47.1
  Top Layer w0.7: U1.19 92.49,21.01 80.81,9.33 TP6.1 58.19,9.33 56.61,10.91 56.61,12.18
GDO0: length 38.6
  Top Layer w0.7: TP7.1 68.68,12.31 66.64,14.34 60.17,14.34 59.12,13.29 H1.6 ; U1.15 v4(87.41,23.36)
  Bottom Layer w0.7: v4(87.41,23.36) 87.41,21.52 TP7.1
GPIO1: length 10.1
  Top Layer w0.7: H1.1 46.34,12.13 TP8.1
GPIO2: length 12
  Top Layer w0.7: TP9.1 44.42,5.83 48.96,10.37 H1.2
GPIO3: length 8.7
  Top Layer w0.7: TP10.1 51.5,8.46 H1.3
GPIO4: length 7.3
  Top Layer w0.7: H1.4 54.07,12.02 TP11.1
MISO: length 38.2
  Top Layer w0.7: U1.16 88.68,22.92 87.73,21.96 60.42,21.96 56.48,25.9 56.48,27.2 H2.5
MOSI: length 45
  Top Layer w0.7: H2.4 54.04,25.81 61.18,18.66 86.2,18.66 90.01,22.47 90.01,25.42 U1.17
SCK: length 44.2
  Top Layer w0.7: U1.18 91.22,21.77 85.31,15.86 TP5.1
  Bottom Layer w0.7: H2.6 59.11,25.17 68.42,15.86 TP5.1
$1N1660: length 8.9
  Top Layer w1.5: D2.2 C7.1 C8.2 H2.1
$1N5727: length 2.9
  Top Layer w0.8: 8.5,43.42 8.5,46.34

## Copper pours and planes (outline as drawn; the poured copper is in the pictures)
GND on Bottom Layer: -1.43,66.92 116.56,66.92 116.56,-0.9 -1.43,-0.9

## Text on the board
Top Silkscreen Layer: Voltage / Supply / Indicat. | XIAO ESP32S3 | Connects to / HEKATRON Genius Plus X / equ. with radio modules / Basis X / Pro X | LDO | XIAO | (USB) | EBYTE / E07-900M10S | SELECTION | 3.3V | V1   07/25 | Genius Gateway | DC Power Jack / 12V DC / Pin: +, 2mm
